# EAGLE schematic board design (EAGLE 7.6.0)
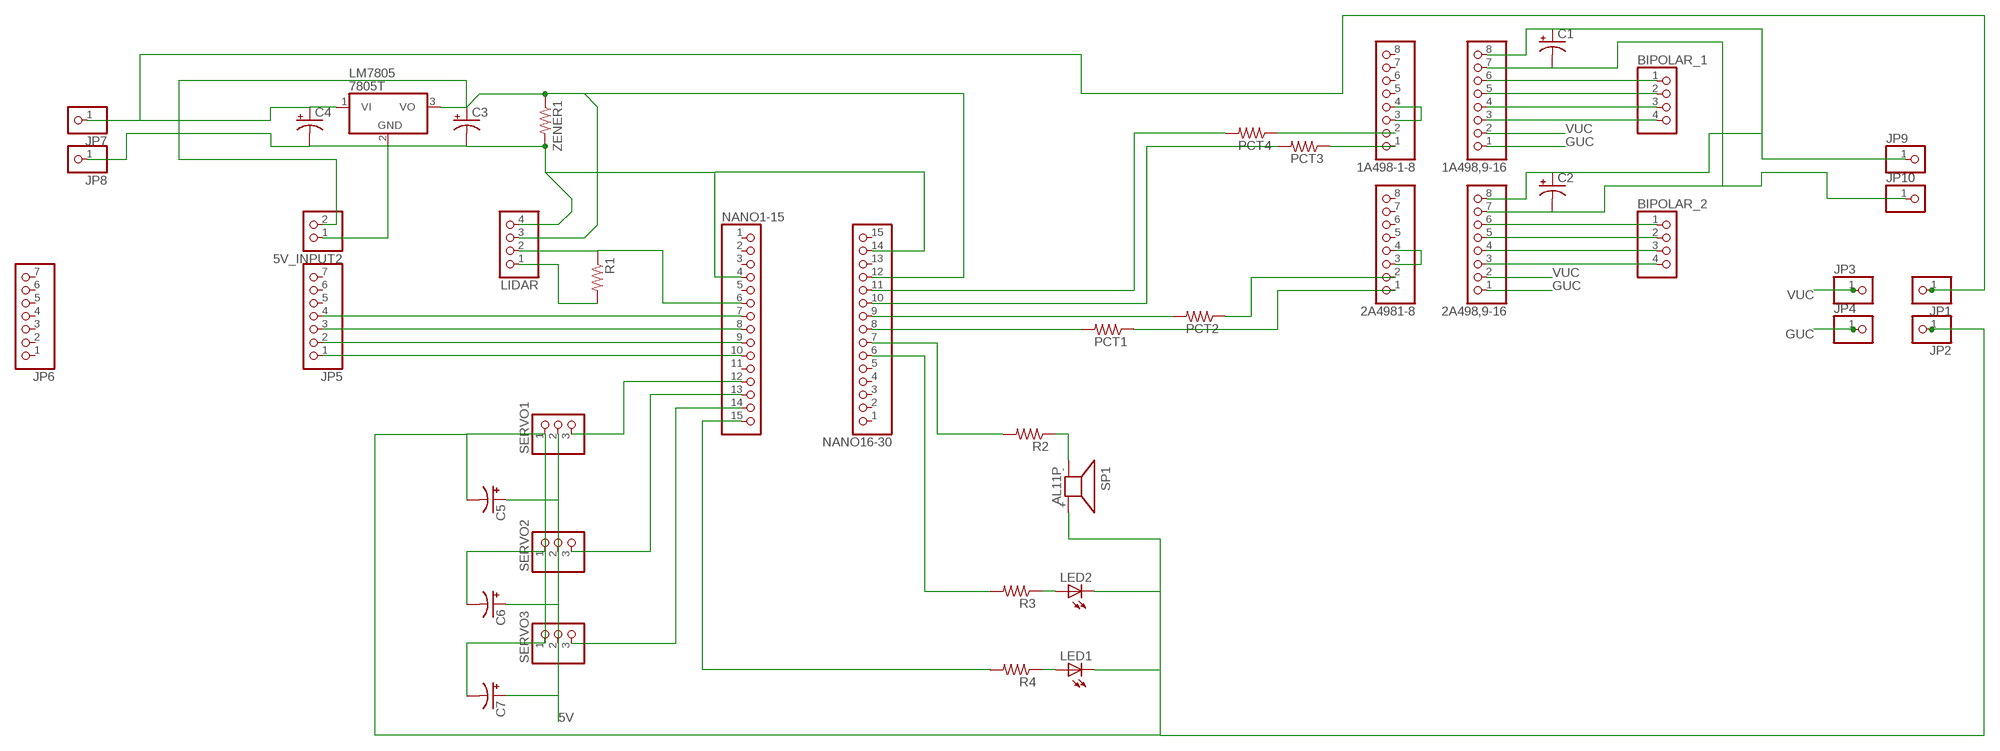
[diagram p0: schematic, sheet 1]

## Parts
1A498,9-16  PINHD-1X8  [1X08]
1A498-1-8  PINHD-1X8  [1X08]
2A498,9-16  PINHD-1X8  [1X08]
2A4981-8  PINHD-1X8  [1X08]
5V_INPUT2  PINHD-1X2  [1X02]
BIPOLAR_1  PINHD-1X4  [1X04]
BIPOLAR_2  PINHD-1X4  [1X04]
C1  CPOL-USE2.5-7  [E2,5-7]
C2  CPOL-USE2.5-7  [E2,5-7]
C3  CPOL-USE2.5-7  [E2,5-7]
C4  CPOL-USE2.5-7  [E2,5-7]
C5  CPOL-USE2.5-7  [E2,5-7]
C6  CPOL-USE2.5-7  [E2,5-7]
C7  CPOL-USE2.5-7  [E2,5-7]
JP1  PINHD-1X1  [1X01]
JP2  PINHD-1X1  [1X01]
JP3  PINHD-1X1  [1X01]
JP4  PINHD-1X1  [1X01]
JP5  PINHD-1X7  [1X07]
JP6  PINHD-1X7  [1X07]
JP7  PINHD-1X1  [1X01]
JP8  PINHD-1X1  [1X01]
JP9  PINHD-1X1  [1X01]
JP10  PINHD-1X1  [1X01]
LED1  LED5MM  [LED5MM]
LED2  LED5MM  [LED5MM]
LIDAR  PINHD-1X4  [1X04]
LM7805  7805T  [TO220H]
NANO1-15  PINHD-1X15  [1X15]
NANO16-30  PINHD-1X15  [1X15]
PCT1  R-US_0207/10  [0207/10]
PCT2  R-US_0207/10  [0207/10]
PCT3  R-US_0207/10  [0207/10]
PCT4  R-US_0207/10  [0207/10]
R1  R-US_0207/10  [0207/10]
R2  R-US_0207/10  [0207/10]
R3  R-US_0207/10  [0207/10]
R4  R-US_0207/10  [0207/10]
SERVO1  PINHD-1X3  [1X03]
SERVO2  PINHD-1X3  [1X03]
SERVO3  PINHD-1X3  [1X03]
SP1  AL11P  [AL11P]
ZENER1  R-US_0207/10  [0207/10]

## Nets
5V: C4.+ C5.+ C6.+ C7.+ JP1.1 JP7.1 LM7805.1(VI) SERVO1.2 SERVO2.2 SERVO3.2
GUC: 1A498,9-16.1 2A498,9-16.1 JP4.1
N$1: JP5.4 NANO1-15.7
N$2: JP5.3 NANO1-15.8
N$3: JP5.2 NANO1-15.9
N$4: JP5.1 NANO1-15.10
N$5: NANO16-30.7 R2.2
N$6: LED2.A R3.1
N$7: 1A498-1-8.2 PCT4.1
N$8: NANO16-30.8 PCT1.2
N$9: 2A498,9-16.6 BIPOLAR_2.1
N$10: 2A498,9-16.5 BIPOLAR_2.2
N$11: 2A498,9-16.4 BIPOLAR_2.3
N$12: 2A498,9-16.3 BIPOLAR_2.4
N$13: 1A498,9-16.6 BIPOLAR_1.1
N$14: 1A498,9-16.5 BIPOLAR_1.2
N$15: 1A498,9-16.4 BIPOLAR_1.3
N$16: 1A498,9-16.3 BIPOLAR_1.4
N$17: LED1.A R4.1
N$18: NANO1-15.15 R4.2
N$19: R2.1 SP1.-
N$20: LIDAR.2 NANO1-15.6 R1.1
N$21: LIDAR.1 R1.2
N$22: 1A498,9-16.7 2A498,9-16.7 C1.- C2.- JP10.1
N$23: 2A4981-8.3 2A4981-8.4
N$24: 1A498-1-8.3 1A498-1-8.4
N$25: 1A498,9-16.8 2A498,9-16.8 C1.+ C2.+ JP9.1
N$26: NANO1-15.12 SERVO1.3
N$27: NANO1-15.13 SERVO2.3
N$28: NANO1-15.14 SERVO3.3
N$29: NANO16-30.11 PCT4.2
N$30: NANO16-30.10 PCT3.2
N$31: NANO16-30.9 PCT2.2
N$32: 2A4981-8.1 PCT1.1
N$33: NANO16-30.6 R3.2
N$34: 2A4981-8.2 PCT2.1
N$35: 1A498-1-8.1 PCT3.1
N$36: C5.- C6.- C7.- JP2.1 LED1.K(C) LED2.K(C) SERVO1.1 SERVO2.1 SERVO3.1 SP1.+
N$37: 5V_INPUT2.2 C3.+ LIDAR.3 LM7805.3(VO) NANO16-30.12 ZENER1.1
N$38: 5V_INPUT2.1 C3.- C4.- JP8.1 LIDAR.4 LM7805.2(GND) NANO1-15.4 NANO16-30.14 ZENER1.2
VUC: 1A498,9-16.2 2A498,9-16.2 JP3.1
Unconnected: 1A498-1-8.5 1A498-1-8.6 1A498-1-8.7 1A498-1-8.8 2A4981-8.5 2A4981-8.6 2A4981-8.7 2A4981-8.8 JP5.5 JP5.6 JP5.7 JP6.1 JP6.2 JP6.3 JP6.4 JP6.5 JP6.6 JP6.7 NANO1-15.1 NANO1-15.2 NANO1-15.3 NANO1-15.5 NANO1-15.11 NANO16-30.1 NANO16-30.2 NANO16-30.3 NANO16-30.4 NANO16-30.5 NANO16-30.13 NANO16-30.15

## Library data of the parts
1A498,9-16 1A498-1-8 2A498,9-16 2A4981-8 = pinhead:PINHD-1X8: PIN HEADER
5V_INPUT2 = pinhead:PINHD-1X2: PIN HEADER
BIPOLAR_1 BIPOLAR_2 LIDAR = pinhead:PINHD-1X4: PIN HEADER
C1-C7 = rcl:CPOL-US: POLARIZED CAPACITOR, American symbol
JP1-JP4 JP7-JP10 = pinhead:PINHD-1X1: PIN HEADER
JP5 JP6 = pinhead:PINHD-1X7: PIN HEADER
LED1 LED2 = led:LED: LED OSRAM: - CHIPLED LG R971, LG N971, LY N971, LG Q971, LY Q971, LO R971, LY R971 LH N974, LH R974 LS Q976, LO Q976, LY Q976 LO Q996 - Hyper CHIPLED LW Q18S LB Q993, LB Q99A, LB R99A - SideLED LS A670, LO A670, LY A670, LG A670, LP A670 LB A673, LV A673, LT A673, LW A673 LH A674 LY A675 LS A676, LA A676, LO A676, LY A676, LW A676 LS A679, LY A679, LG A679 - Hyper Micro SIDELED® LS Y876, LA Y876, LO Y876, LY Y876 LT Y87S - SmartLED LW L88C, LW L88S LB L89C, LB L89S, LG L890 LS L89K, LO L89K, LY L89K LS L896, LA L896, LO L896, LY L896 - TOPLED LS T670, LO T670, LY T670, LG T670, LP T670 LSG T670, LSP T670, LSY T670, LOP T670, LYG T670 LG T671, LOG T671, LSG T671 LB T673, LV T673, LT T673, LW T673 LH T674 LS T676, LA T676, LO T676, LY T676, LB T676, LH T676, LSB T676, LW T676 LB T67C, LV T67C, LT T67C, LS T67K, LO T67K, LY T67K, LW E67C LS E67B, LA E67B, LO E67B, LY E67B, LB E67C, LV E67C, LT E67C LW T67C LS T679, LY T679, LG T679 LS T770, LO T770, LY T770, LG T770, LP T770 LB T773, LV T773, LT T773, LW T773 LH T774 LS E675, LA E675, LY E675, LS T675 LS T776, LA T776, LO T776, LY T776, LB T776 LHGB T686 LT T68C, LB T68C - Hyper Mini TOPLED® LB M676 - Mini TOPLED Santana® LG M470 LS M47K, LO M47K, LY M47K Source: http://www.osram.convergy.de LUXEON: - LUMILED® LXK2-PW12-R00, LXK2-PW12-S00, LXK2-PW14-U00, LXK2-PW14-V00 LXK2-PM12-R00, LXK2-PM12-S00, LXK2-PM14-U00 LXK2-PE12-Q00, LXK2-PE12-R00, LXK2-PE12-S00, LXK2-PE14-T00, LXK2-PE14-U00 LXK2-PB12-K00, LXK2-PB12-L00, LXK2-PB12-M00, LXK2-PB14-N00, LXK2-PB14-P00, LXK2-PB14-Q00 LXK2-PR12-L00, LXK2-PR12-M00, LXK2-PR14-Q00, LXK2-PR14-R00 LXK2-PD12-Q00, LXK2-PD12-R00, LXK2-PD12-S00 LXK2-PH12-R00, LXK2-PH12-S00 LXK2-PL12-P00, LXK2-PL12-Q00, LXK2-PL12-R00 Source: www.luxeon.com KINGBRIGHT: KA-3528ASYC Source: www.kingbright.com
LM7805 = linear:78*: Positive VOLTAGE REGULATOR Source: http://cache.national.com/ds/LM/LM78L05.pdf http://www.fairchildsemi.com/ds/LM/LM7805.pdf
NANO1-15 NANO16-30 = pinhead:PINHD-1X15: PIN HEADER
PCT1-PCT4 R1-R4 ZENER1 = resistor:R-US_: RESISTOR, American symbol
SERVO1-SERVO3 = pinhead:PINHD-1X3: PIN HEADER
SP1 = buzzer:AL11P: SPEAKER Source: Buerklin; OC_FARNELL: unknown; OC_NEWARK: unknown

## Net classes
0 default: width 0.813 mm, drill 0.813 mm, clearance 0.813 mm